# Altium schematic sheet Digitalización_SeñalEMG.SchDoc
size A4; SheetNumber: 1; SheetTotal: 1; SPICEModelCacheQXIPFCYP: <root> / <DocumentId>QXIPFCYP</DocumentId> / </root>
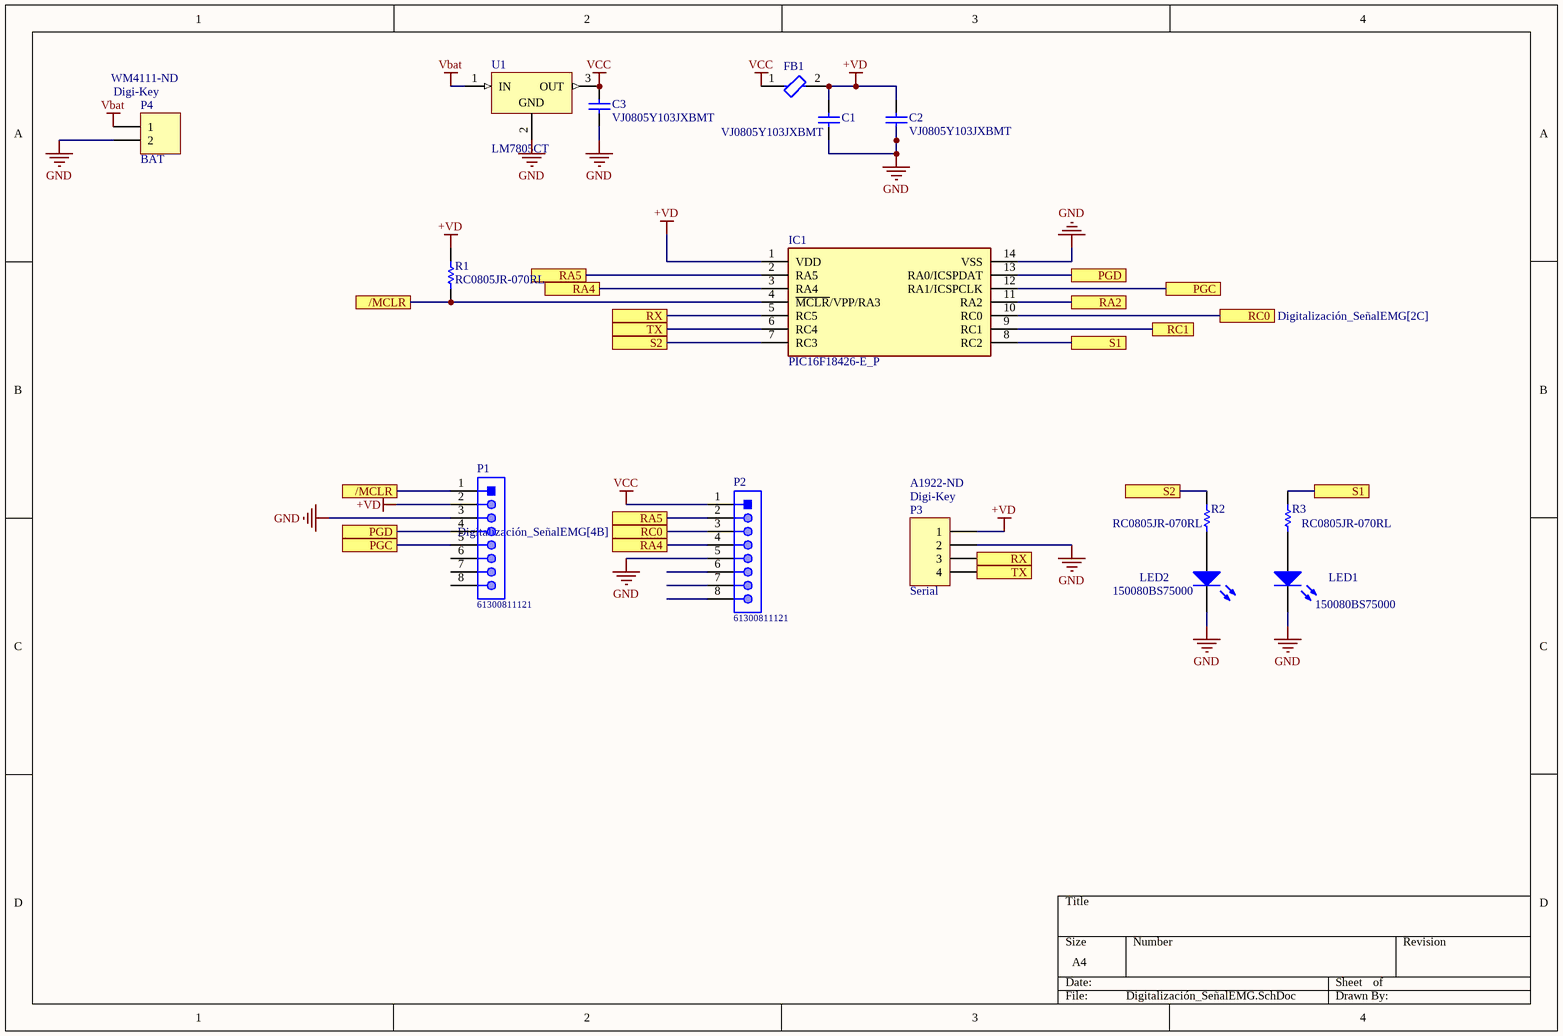
[diagram p0: Digitalización_SeñalEMG.SchDoc]

## Parts
C1  VJ0805Y103JXBMT  [CAPC2013X145X48LL20T23]
C2  VJ0805Y103JXBMT  [CAPC2013X145X48LL20T23]
C3  VJ0805Y103JXBMT  [CAPC2013X145X48LL20T23]
FB1  FBMH3225HM102NT  [FP-FBMH3225-IPC_B]  (value not drawn)
IC1  PIC16F18426-E_P  [DIP781W56P254L1918H533Q14N]
LED1  150080BS75000  [0805_A]
LED2  150080BS75000  [0805_A]
P1  61300811121  [61300811121]
P2  61300811121  [61300811121]
P3  Serial  Supplier 1: Digi-Key  Supplier Part Number 1: A1922-ND  [HDR1X4]
P4  BAT  Supplier 1: Digi-Key  Supplier Part Number 1: WM4111-ND  [HDR1X2]
R1  RC0805JR-070RL  [RESC2013X60X35ML10T20]
R2  RC0805JR-070RL  [RESC2013X60X35ML10T20]
R3  RC0805JR-070RL  [RESC2013X60X35ML10T20]
U1  LM7805CT  [FAIR-TO-220-3]

## Ports
/MCLR (see Digitalización_SeñalEMG[1B]), PGC (see Digitalización_SeñalEMG[1C]), PGC (see Digitalización_SeñalEMG[3B]), PGD (see Digitalización_SeñalEMG[1C]), PGD (see Digitalización_SeñalEMG[3B]), RA2, RA4 (see Digitalización_SeñalEMG[2B]), RA4 (see Digitalización_SeñalEMG[2C]), RA5 (see Digitalización_SeñalEMG[2B]), RA5 (see Digitalización_SeñalEMG[2C]), RC0 (see Digitalización_SeñalEMG[2C]), RC0 (see Digitalización_SeñalEMG[4B]), RC1, RX (see Digitalización_SeñalEMG[2B]), RX (see Digitalización_SeñalEMG[3C]), S1 (see Digitalización_SeñalEMG[3B]), S1 (see Digitalización_SeñalEMG[4B]), S2 (see Digitalización_SeñalEMG[2B]), S2 (see Digitalización_SeñalEMG[3B]), TX (see Digitalización_SeñalEMG[2B]), TX (see Digitalización_SeñalEMG[3C])

## Nets
+VD: C1.1 C2.1 FB1.2 IC1.1(VDD) P1.2 P3.1 R1.2
GND: C1.2 C2.2 C3.1 IC1.14(VSS) LED1.1(K) LED2.1(K) P1.3 P2.5 P3.2 P4.2 U1.2(GND)
Vbat: P4.1 U1.1(IN)
VCC: C3.2 FB1.1 P2.1 U1.3(OUT)
/MCLR: IC1.4(~{MCLR}/VPP/RA3) P1.1 R1.1 ; port /MCLR
PGC: IC1.12(RA1/ICSPCLK) P1.5 ; port PGC
PGD: IC1.13(RA0/ICSPDAT) P1.4 ; port PGD
RA2: IC1.11(RA2) ; port RA2
RA4: IC1.3(RA4) P2.4 ; port RA4
RA5: IC1.2(RA5) P2.2 ; port RA5
RC0: IC1.10(RC0) P2.3 ; port RC0
RC1: IC1.9(RC1) ; port RC1
RX: IC1.5(RC5) P3.3 ; port RX
S1: IC1.8(RC2) R3.2 ; port S1
S2: IC1.7(RC3) R2.2 ; port S2
TX: IC1.6(RC4) P3.4 ; port TX
NetLED1_2: LED1.2(A) R3.1
NetLED2_2: LED2.2(A) R2.1

Not connected (* = marked no-connect by the designer): P1 6 7 8; P2 6 7 8

## Library data of the parts
C1-C3 = CMP-2007-01883-1: Manufacturer: Vitramon; Part Number: VJ0805Y103JXBMT
FB1 = CMP-2000-06239-3: FERRITE BEAD 1 KOHM 1210 1LN; Frequency: 100MHz; Current Rating: 2A; Number of Lines: 1; Impedance: 1kR; Shielding: Unshielded; Tolerance: 30%; Resistance: 100mR; Package Quantity: 1; Max Operating Temperature: 125°C; Length: 3.2mm; Height: 2.8mm; Lead Free: Lead Free; Case/Package: 1210; Case Code (Imperial): 1210; Termination: SMD/SMT; Min Operating Temperature: -40°C; Width: 0.098inch; Halogen Free: Halogen Free; Max DC Current: 2A; Core Material: Ferrite; Depth: 2.8mm; Mount: Surface Mount; Test Frequency: 100MHz; RoHS Compliant: Yes; Number of Pins: 2; Max Current Rating: 2A; DC Resistance (DCR): 100mR; Material: Ferrite; Series: FB; Packaging: Tape and Reel; Case Code (Metric): 3225; Resistor Type: Ferrite Bead
IC1 = PIC16F18426-E_P: Integrated Circuit; Manufacturer_Name: Microchip; Manufacturer_Part_Number: PIC16F18426-E/P; Datasheet Link: http://ww1.microchip.com/downloads/en/DeviceDoc/Microchip-8-bit-PIC-MCU-PIC16(L)F18426_46-Datasheet-40001985A.pdf; Height: 5.334mm; Mouser Part Number: 579-PIC16F18426-E/P; Mouser Price/Stock: https://www.mouser.co.uk/ProductDetail/Microchip-Technology/PIC16F18426-E-P?qs=rrS6PyfT74dRYO4qd7TFuw%3D%3D; Arrow Part Number: PIC16F18426-E/P; Arrow Price/Stock: https://www.arrow.com/en/products/pic16f18426-ep/microchip-technology?region=nac
LED1 LED2 = CMP-1426-00008-1: SMD mono-color Chip LED, WL-SMCW, Blue; Manufacturer: Wuerth Elektronik; Color: Blue; ComponentLink2URL: http://katalog.we-online.com/led/datasheet/150080BS75000.pdf; ComponentLink1URL: http://www.we-online.com; ComponentLink2Description: Datasheet; PackageReference: 0805_A; ComponentLink1Description: Manufacturer URL; PartNumber: 150080BS75000
P1 P2 = CMP-1502-01076-1: THT Vertical Pin Header WR-PHD, Pitch 2.54 mm, Single Row, 8 pins; Manufacturer: Wurth Elektronik; Rated Current: 3A; Pin Number: 8; Working Voltage: 250VAC; Gender: Male; Contact Resistance: 20mOhm; Pitch: 2.54mm; Withstanding Voltage: 500VAC; Publisher: WurthElektronik; Operating Temperature: -40to105degC; Orientation: Vertical; Row Number: Single; Part Number: 61300811121; Package Reference: 61300811121; Mounting Technology: THT; Packaging: Bag; Manufacturer URL: http://www.we-online.de; Datasheet URL: https://katalog.we-online.de/em/datasheet/6130xx11121.pdf
P3 = Header 4: Header, 4-Pin; LatestRevisionDate: 17-Jul-2002; LatestRevisionNote: Re-released for DXP Platform.; Publisher: Altium Limited
P4 = Header 2: Header, 2-Pin; LatestRevisionDate: 17-Jul-2002; LatestRevisionNote: Re-released for DXP Platform.; Publisher: Altium Limited
R1-R3 = CMP-2100-03673-1: Chip Resistor, 0 Ohm, Jumper, +/- 5%, 0.125 W, -55 to 155 degC, 0805 (2012 Metric), RoHS, Tape and Reel; Manufacturer: Yageo; Power Rating: 125mW; Resistance: 0mOhm; Voltage Rating (DC): 150V; Temperature Coefficient: 200ppm/degreesC; Height: 0.5mm; Depth: 1.25mm; Case Code (Imperial): 0805; Lead Free: LeadFree; Military Standard: Not; Package Description: 2-Pin Surface Mounted Device, Body 2 x 1.25 mm; Case Code (Metric): 2012; Composition: ThickFilm; Voltage Rating: 150V; Manufacturer URL: http://www.yageo.com/; Packaging: TapeandReel; Package Reference: 0805; REACH SVHC: Unknown; Tolerance: 5%; Case/Package: 0805; Max Operating Temperature: 155degC; Number of Pins: 2; Min Operating Temperature: -55degC; RoHSCompliant: true; Length: 2mm; Datasheet URL: http://www.yageo.com/NewPortal/yageodocoutput?fileName=/pdf/R-Chip/PYu-RC_Group_51_RoHS_L_5.pdf; Termination: SMD/SMT; Radiation Hardening: No; Width: 1.25mm; Contact Plating: Tin; Datasheet Version: Rev. 5, 10/2016
U1 = CMP-2000-04938-1: Positive Voltage Regulator, 5 V, 1 A, -40 to 125 degC, 3-Pin TO-220, RoHS, Tube; Manufacturer: FairchildSemiconductor; Maximum Input Voltage: 35V; Maximum Quiescent Current: 8mA; Load Regulation: 100mV; Maximum Output Current: 2.2(Typ)A; Output Type: Fixed; Typical Dropout Voltage @ Current: 2@1AV; Rad Hard: No; Output Voltage: 5V; Accuracy: ±4%; Number of Outputs: 1; Category: LinearRegulator; Package Description: 3-Pin Through Hole Device, Body 10 x 4.5 mm, Pitch 2.54 mm; Packaging: Rail/Tube; Mounting: ThroughHole; Polarity: Positive; Manufacturer URL: https://www.fairchildsemi.com/; Line Regulation: 100mV; Datasheet Version: Aug-12; Datasheet URL: https://datasheet.ciiva.com/26904/lm7805ct-26904988.pdf; Package Reference: TO-220; Package URL: https://www.fairchildsemi.com/package-drawings/TO/TO220B03.pdf; Package: 3TO-220AB; Operating Temperature: -40to125degC; Type: Linear